# EAGLE schematic DuinoMite_Rev_C (EAGLE 4.16)
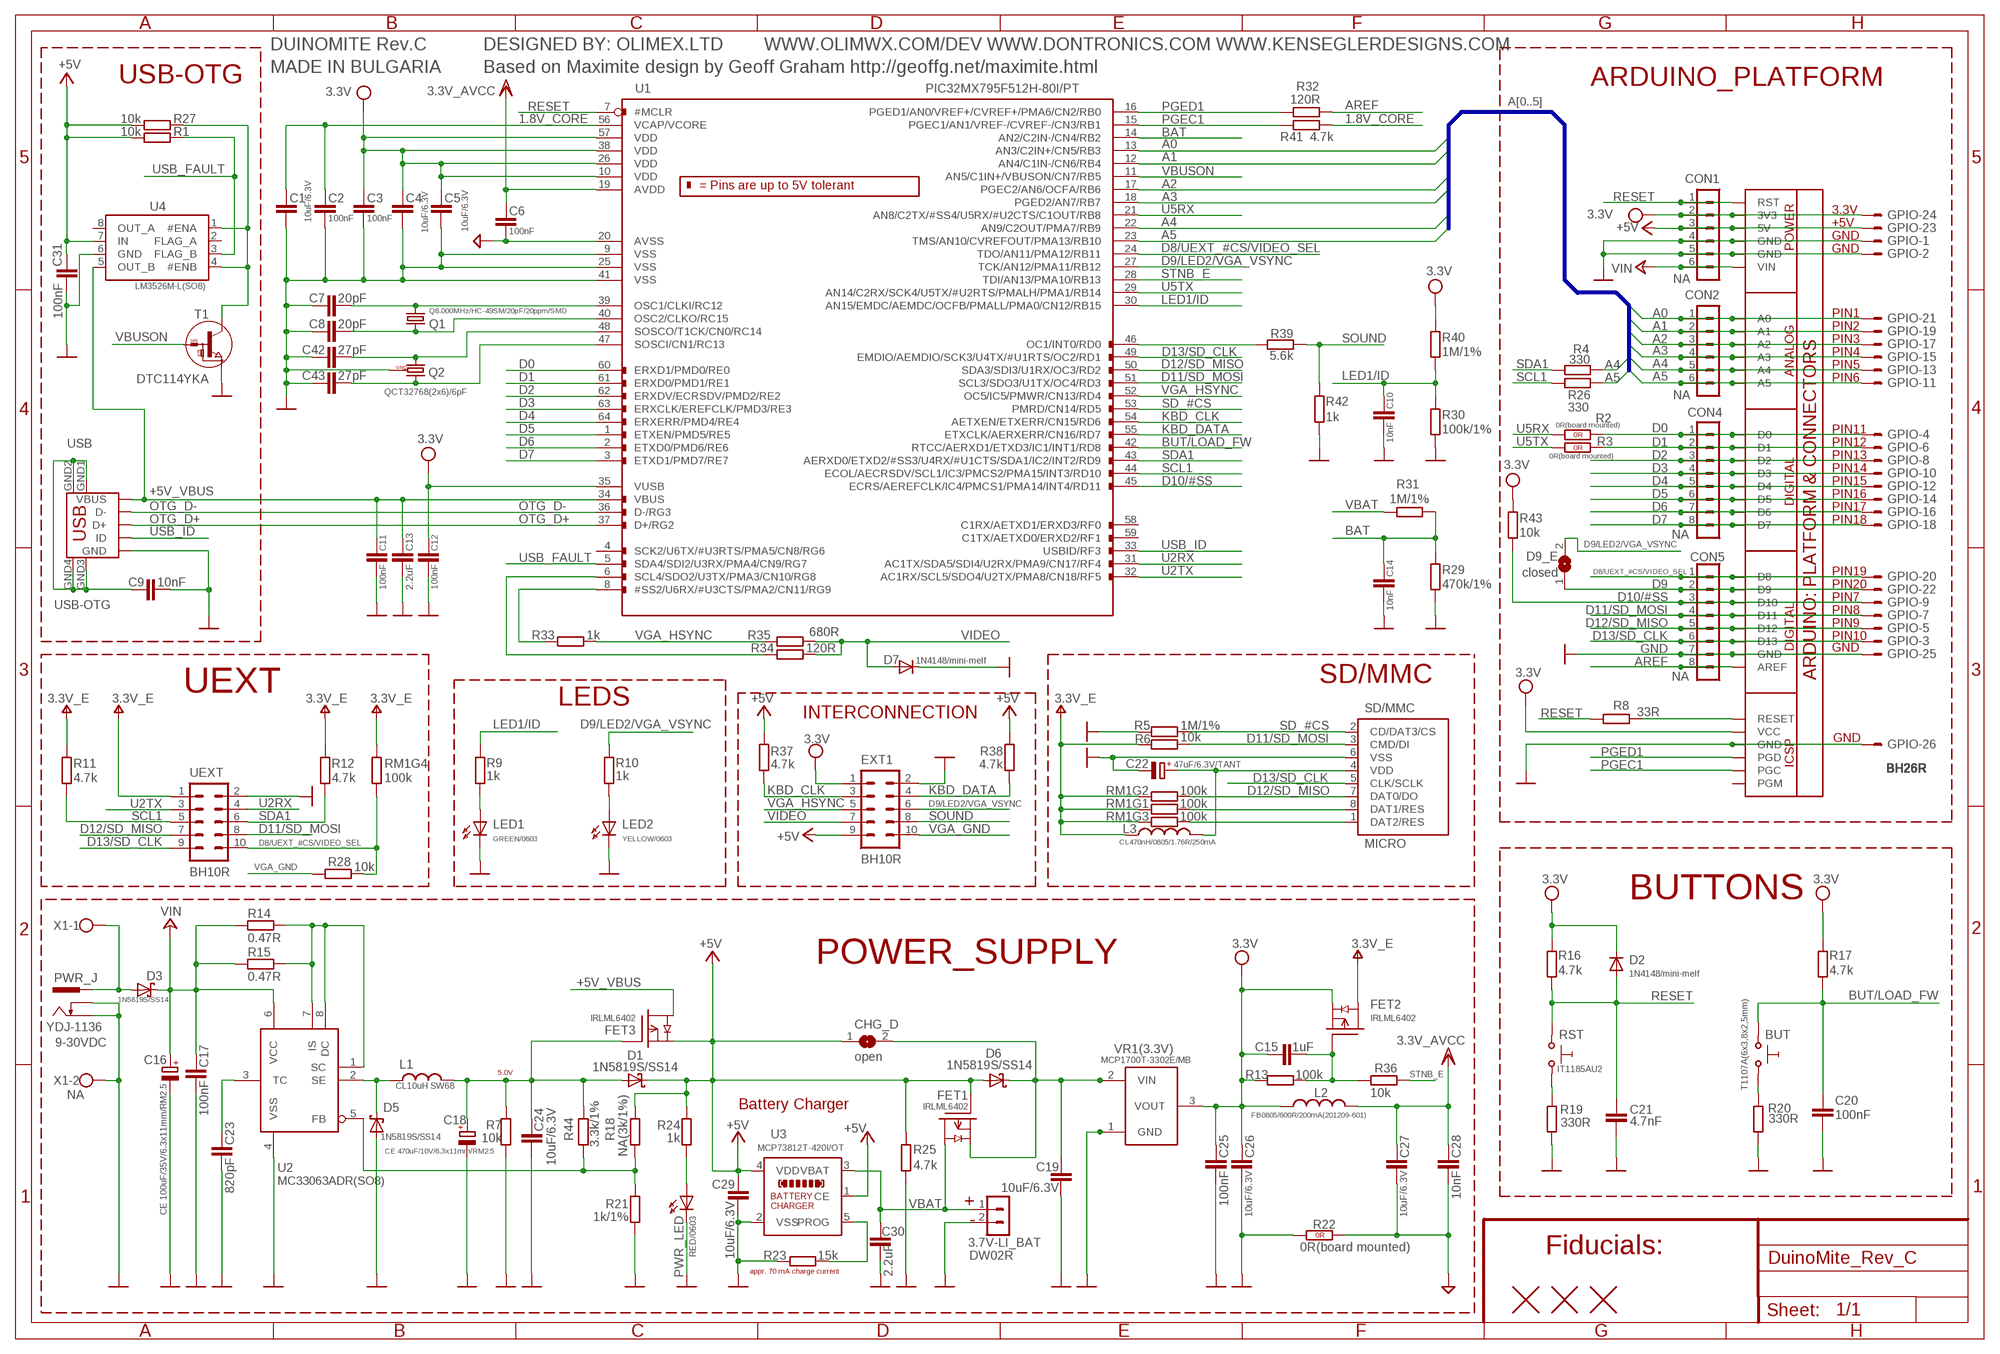
[diagram p0: schematic, sheet 1]

## Parts
3.7V-LI_BAT  DW02R  CON2DW02R  [DW02R]
BUT  T1107A(6x3,8x2,5mm)  SW-TAKTT1107A(6X3,8X2,5MM)  [WS-TAKT_6X3.5_SMD_NOCREAM]
C1  10uF/6.3V  C-EUC0805_5MIL_DWS  [C0805_5MIL_DWS]
C2  100nF  C-EUC0603_DWS  [C0603_DWS]
C3  100nF  C-EUC0603_DWS  [C0603_DWS]
C4  10uF/6.3V  C-EUC0603_DWS  [C0603_DWS]
C5  10uF/6.3V  C-EUC0603_DWS  [C0603_DWS]
C6  100nF  C-EUC0603_DWS  [C0603_DWS]
C7  20pF  C-EUC0603_DWS  [C0603_DWS]
C8  20pF  C-EUC0603_DWS  [C0603_DWS]
C9  10nF  C-EUC0603_DWS  [C0603_DWS]
C10  10nF  C-EUC0603_DWS  [C0603_DWS]
C11  100nF  C-EUC0603_DWS  [C0603_DWS]
C12  100nF  C-EUC0603_DWS  [C0603_DWS]
C13  2.2uF  C-EUC0603_DWS  [C0603_DWS]
C14  10nF  C-EUC0603_DWS  [C0603_DWS]
C15  1uF  C-EUC0603_DWS  [C0603_DWS]
C16  CE 100uF/35V/6.3x11mm/RM2.5  CPOL-EUE2.5-6.3  [E2,5-6,3]
C17  100nF  C-EUC0603_DWS  [C0603_DWS]
C18  CE 470uF/10V/6.3x11mm/RM2.5  CPOL-EUE2.5-6.3  [E2,5-6,3]
C19  10uF/6.3V  C-EUC0603_DWS  [C0603_DWS]
C20  100nF  C-EUC0603_DWS  [C0603_DWS]
C21  4.7nF  C-EUC0603_DWS  [C0603_DWS]
C22  47uF/6.3V/TANT  CPOL-EUCT3528  [CT3528]
C23  820pF  C-EUC0603_DWS  [C0603_DWS]
C24  10uF/6.3V  C-EUC0805_5MIL_DWS  [C0805_5MIL_DWS]
C25  100nF  C-EUC0603_DWS  [C0603_DWS]
C26  10uF/6.3V  C-EUC0805_5MIL_DWS  [C0805_5MIL_DWS]
C27  10uF/6.3V  C-EUC0805_5MIL_DWS  [C0805_5MIL_DWS]
C28  10nF  C-EUC0603_DWS  [C0603_DWS]
C29  10uF/6.3V  C-EUC0603_DWS  [C0603_DWS]
C30  2.2uF  C-EUC0603_DWS  [C0603_DWS]
C31  100nF  C-EUC0603_DWS  [C0603_DWS]
C42  27pF  C-EUC0603_DWS  [C0603_DWS]
C43  27pF  C-EUC0603_DWS  [C0603_DWS]
CHG_D  open  SJSJ_SMALLER  [SJ_1_SMALLER]
CON1  NA  CON6PN1X6  [PN1X6]
CON2  NA  CON6PN1X6  [PN1X6]
CON4  NA  CON8PN1X8  [PN1X8]
CON5  NA  CON8PN1X8  [PN1X8]
D1  1N5819S/SS14  SCHOTKKY7.62SS2  [MLL-41]
D2  1N4148/mini-melf  DSMD  [MINI-MELF]
D3  1N5819S/SS14  SCHOTKKY7.62SS2  [MLL-41]
D5  1N5819S/SS14  SCHOTKKY7.62SS2  [MLL-41]
D6  1N5819S/SS14  SCHOTKKY7.62SS2  [MLL-41]
D7  1N4148/mini-melf  DSMD  [MINI-MELF]
D9_E  closed  SJSJ_1_SMALLER_CLOSE  [SJ_1_SMALLER_CLOSE]
EXT1  BH10R  ML10R  [BH10R]
FET1  IRLML6402  [SOT23]
FET2  IRLML6402  [SOT23]
FET3  IRLML6402  [SOT23]
GPIO  BH26R  ML26RE  [BH26R]
L1  CL10uH SW68  LSW68  [SW68]
L2  FB0805/600R/200mA(201209-601)  L-USL0805_5MIL_DWS  [L0805_5MIL_DWS]
L3  CL470nH/0805/1.76R/250mA  L-USL0805_5MIL_DWS  [L0805_5MIL_DWS]
LED1  GREEN/0603  LED0603DWS  [LED-0603]
LED2  YELLOW/0603  LED0603DWS  [LED-0603]
PWR_J  YDJ-1136  PWR-JAKPWR_JACK_UNI_MILLING  [PWR_JACK_UNI_MILLING]
PWR_LED  RED/0603  LED0603DWS  [LED-0603]
Q1  Q8.000MHz/HC-49SM/20pF/20ppm/SMD  HC49/S1  [HC49/SMD2_THIN]
Q2  QCT32768(2x6)/6pF  Q_GND1  [TC26H_3_REPAIR_SMD]
R1  10k  R-EU_R0603_5MIL_DWS  [R0603_5MIL_DWS]
R2  0R(board mounted)  R_0R0R(NA)  [0603_0R]
R3  0R(board mounted)  R_0R0R(NA)  [0603_0R]
R4  330  R-EU_R0603_5MIL_DWS  [R0603_5MIL_DWS]
R5  1M/1%  R-EU_R0603_5MIL_DWS  [R0603_5MIL_DWS]
R6  10k  R-EU_R0603_5MIL_DWS  [R0603_5MIL_DWS]
R7  10k  R-EU_R0603_5MIL_DWS  [R0603_5MIL_DWS]
R8  33R  R-EU_R0603_5MIL_DWS  [R0603_5MIL_DWS]
R9  1k  R-EU_R0603_5MIL_DWS  [R0603_5MIL_DWS]
R10  1k  R-EU_R0603_5MIL_DWS  [R0603_5MIL_DWS]
R11  4.7k  R-EU_R0603_5MIL_DWS  [R0603_5MIL_DWS]
R12  4.7k  R-EU_R0603_5MIL_DWS  [R0603_5MIL_DWS]
R13  100k  R-EU_R0603_5MIL_DWS  [R0603_5MIL_DWS]
R14  0.47R  R-EU_R1206_5MIL_WS  [R1206_5MIL_WS]
R15  0.47R  R-EU_R1206_5MIL_WS  [R1206_5MIL_WS]
R16  4.7k  R-EU_R0603_5MIL_DWS  [R0603_5MIL_DWS]
R17  4.7k  R-EU_R0603_5MIL_DWS  [R0603_5MIL_DWS]
R18  NA(3k/1%)  R-EU_R0603_5MIL_DWS  [R0603_5MIL_DWS]
R19  330R  R-EU_R0603_5MIL_DWS  [R0603_5MIL_DWS]
R20  330R  R-EU_R0603_5MIL_DWS  [R0603_5MIL_DWS]
R21  1k/1%  R-EU_R0603_5MIL_DWS  [R0603_5MIL_DWS]
R22  0R(board mounted)  R_0R0R(NA)  [0603_0R]
R23  15k  R-EU_R0603_5MIL_DWS  [R0603_5MIL_DWS]
R24  1k  R-EU_R0603_5MIL_DWS  [R0603_5MIL_DWS]
R25  4.7k  R-EU_R0603_5MIL_DWS  [R0603_5MIL_DWS]
R26  330  R-EU_R0603_5MIL_DWS  [R0603_5MIL_DWS]
R27  10k  R-EU_R0603_5MIL_DWS  [R0603_5MIL_DWS]
R28  10k  R-EU_R0603_5MIL_DWS  [R0603_5MIL_DWS]
R29  470k/1%  R-EU_R0603_5MIL_DWS  [R0603_5MIL_DWS]
R30  100k/1%  R-EU_R0603_5MIL_DWS  [R0603_5MIL_DWS]
R31  1M/1%  R-EU_R0603_5MIL_DWS  [R0603_5MIL_DWS]
R32  120R  R-EU_R0603_5MIL_DWS  [R0603_5MIL_DWS]
R33  1k  R-EU_R0603_5MIL_DWS  [R0603_5MIL_DWS]
R34  120R  R-EU_R0603_5MIL_DWS  [R0603_5MIL_DWS]
R35  680R  R-EU_R0603_5MIL_DWS  [R0603_5MIL_DWS]
R36  10k  R-EU_R0603_5MIL_DWS  [R0603_5MIL_DWS]
R37  4.7k  R-EU_R0603_5MIL_DWS  [R0603_5MIL_DWS]
R38  4.7k  R-EU_R0603_5MIL_DWS  [R0603_5MIL_DWS]
R39  5.6k  R-EU_R0603_5MIL_DWS  [R0603_5MIL_DWS]
R40  1M/1%  R-EU_R0603_5MIL_DWS  [R0603_5MIL_DWS]
R41  4.7k  R-EU_R0603_5MIL_DWS  [R0603_5MIL_DWS]
R42  1k  R-EU_R0603_5MIL_DWS  [R0603_5MIL_DWS]
R43  10k  R-EU_R0603_5MIL_DWS  [R0603_5MIL_DWS]
R44  3.3k/1%  R-EU_R0603_5MIL_DWS  [R0603_5MIL_DWS]
RM1  100k  R_MATRIX_4E  [R_MATRIX_4]
RST  IT1185AU2  SW-TAKTIT1185AU2  [IT1185AU2]
SD/MMC  MICRO  MICRO_SD/MMC  [TFR-MEM-CON]
T1  DTC114YKA  DIGITAL_TRANSISTORS-NPNDTC114YKA  [SOT-23]
U1  PIC32MX795F512H-80I/PT  PIC32MX795F512HT-80I/PT  [LPTQFP64]
U2  MC33063ADR(SO8)  MC34063A_OFF  [SO-8_TRM]
U3  MCP73812T-420I/OT  MCP7381XSOT-23-5  [SOT-23-5]
U4  LM3526M-L(SO8)  LM3526-L  [SO-8]
U$1  2xPN1x8+2xPN1x6+WU06S  PIC_PLATFORMMITE  [PIC_PLATFORM_MAXMITE]
U$2  FIDUCIAL1X2  [FIDUCIAL-1X2]
U$3  FIDUCIAL1X2  [FIDUCIAL-1X2]
U$4  FIDUCIAL1X2  [FIDUCIAL-1X2]
UEXT  BH10R  ML10R  [BH10R]
USB  USB-OTG  MINI_USB9  [USB_MINI_9PIN]
VR1(3.3V)  MCP1700T-3302E/MB  MCP1700-REP1  [SOT89_REP_THERMALOFF]
X1  NA  W237-102  [W237-102]

## Nets
1.8V_CORE: C1.1 C2.1 R41.1 U1.56(VCAP/VCORE)
+5V: C29.1 C31.1 CHG_D.1 CON1.3 D1.K(C) D6.A EXT1.9 FET1.1(G) FET3.2(S) GPIO.23 R1.2 R18.1 R24.1 R25.1 R27.2 R37.2 R38.2 U3.1(CE) U3.4(VDD) U4.7(IN) U$1.5V
+5V_VBUS [pwr]: C11.2 C13.1 FET3.3(D) U1.34(VBUS) U4.5(OUT_B) USB.VBUS
+24V: C16.+ C17.1 CON1.6 D3.K(C) R14.1 R15.1 U2.6(VCC) U$1.VIN ; supply symbol labelled VIN
A0: CON2.1 GPIO.21 U1.13(AN3/C2IN+/CN5/RB3) U$1.A0
A1: CON2.2 GPIO.19 U1.12(AN4/C1IN-/CN6/RB4) U$1.A1
A2: CON2.3 GPIO.17 U1.17(PGEC2/AN6/OCFA/RB6) U$1.A2
A3: CON2.4 GPIO.15 U1.18(PGED2/AN7/RB7) U$1.A3
A4: CON2.5 GPIO.13 R4.1 U1.22(AN9/C2OUT/PMA7/RB9) U$1.A4
A5: CON2.6 GPIO.11 R26.1 U1.23(TMS/AN10/CVREFOUT/PMA13/RB10) U$1.A5
AGND: C6.2 C27.2 C28.2 R22.2(1.2) U1.20(AVSS)
AREF: CON5.8 R32.1 U$1.AREF
BAT: C14.2 R29.2 R31.1 U1.14(AN2/C2IN-/CN4/RB2)
BUT/LOAD_FW: BUT.P$1 C20.1 R17.2 U1.42(RTCC/AERXD1/ETXD3/IC1/INT1/RD8)
D0: CON4.1 GPIO.4 R2.2(1.2) U1.60(ERXD1/PMD0/RE0) U$1.D0
D1: CON4.2 GPIO.6 R3.2(1.2) U1.61(ERXD0/PMD1/RE1) U$1.D1
D2: CON4.3 GPIO.8 U1.62(ERXDV/ECRSDV/PMD2/RE2) U$1.D2
D3: CON4.4 GPIO.10 U1.63(ERXCLK/EREFCLK/PMD3/RE3) U$1.D3
D4: CON4.5 GPIO.12 U1.64(ERXERR/PMD4/RE4) U$1.D4
D5: CON4.6 GPIO.14 U1.1(ETXEN/PMD5/RE5) U$1.D5
D6: CON4.7 GPIO.16 U1.2(ETXD0/PMD6/RE6) U$1.D6
D7: CON4.8 GPIO.18 U1.3(ETXD1/PMD7/RE7) U$1.D7
D8/UEXT_#CS/VIDEO_SEL: CON5.1 GPIO.20 R28.2 RM1.4.2 U1.24(TDO/AN11/PMA12/RB11) U$1.D8 UEXT.10
D9: CON5.2 D9_E.1 GPIO.22 U$1.D9
D9/LED2/VGA_VSYNC: D9_E.2 EXT1.6 R10.2 U1.27(TCK/AN12/PMA11/RB12)
D10/#SS: CON5.3 GPIO.9 R43.1 U1.45(ECRS/AEREFCLK/IC4/PMCS1/PMA14/INT4/RD11) U$1.D10
D11/SD_MOSI: CON5.4 GPIO.7 R6.1 SD/MMC.3(CMD/DI) U1.51(SCL3/SDO3/U1TX/OC4/RD3) U$1.D11 UEXT.8
D12/SD_MISO: CON5.5 GPIO.5 RM1.2.2 SD/MMC.7(DAT0/DO) U1.50(SDA3/SDI3/U1RX/OC3/RD2) U$1.D12 UEXT.7
D13/SD_CLK: CON5.6 GPIO.3 SD/MMC.5(CLK/SCLK) U1.49(EMDIO/AEMDIO/SCK3/U4TX/#U1RTS/OC2/RD1) U$1.D13 UEXT.9
GND [pwr]: 3.7V-LI_BAT.2 C1.2 C2.2 C3.2 C4.2 C5.2 C7.1 C8.1 C9.1 C10.1 C11.1 C12.1 C13.2 C14.1 C16.- C17.2 C18.- C19.2 C20.2 C21.2 C22.- C23.2 C24.2 C25.2 C26.2 C29.2 C30.2 C31.2 C42.1 C43.1 CON1.4 CON1.5 CON5.7 D5.A D7.C(K) EXT1.2 GPIO.1 GPIO.2 GPIO.25 GPIO.26 LED1.C LED2.C PWR_J.- PWR_J.-- PWR_LED.C Q2.GND R5.2 R7.2 R19.1 R20.1 R21.2 R22.1(1.1) R23.1 R25.2 R29.1 R30.1 R42.1 SD/MMC.6(VSS) T1.2(E) U1.9(VSS) U1.25(VSS) U1.41(VSS) U2.4(VSS) U3.2(VSS) U4.6(GND) U$1.GND U$1.GND@1(GND) U$1.GND@2(GND) U$1.GND@3(GND) UEXT.2 USB.GND VR1(3.3V).1(GND) X1.2
KBD_CLK: EXT1.3 R37.1 U1.54(AETXEN/ETXERR/CN15/RD6)
KBD_DATA: EXT1.4 R38.1 U1.55(ETXCLK/AERXERR/CN16/RD7)
LED1/ID: C10.2 R9.2 R30.2 R40.1 U1.30(AN15/EMDC/AEMDC/OCFB/PMALL/PMA0/CN12/RB15)
MCIDAT1: RM1.1.2 SD/MMC.8(DAT1/RES)
MCIDAT2: RM1.3.2 SD/MMC.1(DAT2/RES)
N$1: C18.+ C24.1 D1.A FET3.1(G) L1.2 R7.1 R44.1
N$2: C42.2 Q2.1 U1.48(SOSCO/T1CK/CN0/RC14)
N$3: R39.1 U1.46(OC1/INT0/RD0)
N$4: R8.1 U$1.RESET
N$5: LED2.A R10.1
N$6: R27.1 T1.3(C) U4.1(#ENA) U4.4(#ENB)
N$8: PWR_LED.A R24.2
N$9: C15.2 FET2.1(G) R13.2 R36.1
N$11 [pwr]: R19.2 RST.2
N$12 [pwr]: BUT.P$2 R20.2
N$13: D3.A PWR_J.+ X1.1
N$17: C7.2 Q1.2 U1.39(OSC1/CLKI/RC12)
N$18: R34.1 U1.6(SCL4/SDO2/U3TX/PMA3/CN10/RG8)
N$19: C8.2 Q1.1 U1.40(OSC2/CLKO/RC15)
N$22: R23.2 U3.5(PROG)
N$23: LED1.A R9.1
N$24: R33.1 U1.8(#SS2/U6RX/#U3CTS/PMA2/CN11/RG9)
N$28: C43.2 Q2.2 U1.47(SOSCI/CN1/RC13)
N$33: C23.1 U2.3(TC)
N$34: C19.1 CHG_D.2 D6.K(C) FET1.2(S) VR1(3.3V).2(VIN) VR1(3.3V).P$2(VIN1)
N$61: R18.2 R21.1 R44.2 U2.5(FB)
N$64: R14.2 R15.2 U2.1(SC) U2.7(IS) U2.8(DC)
N$67 [pwr]: D5.K(C) L1.1 U2.2(SE)
N$116: C22.+ L3.2 SD/MMC.4(VDD)
OTG_D+: U1.37(D+/RG2) USB.D+
OTG_D-: U1.36(D-/RG3) USB.D-
PGEC1: R41.2 U1.15(PGEC1/AN1/VREF-/CVREF-/CN3/RB1) U$1.PGC
PGED1: R32.2 U1.16(PGED1/AN0/VREF+/CVREF+/PMA6/CN2/RB0) U$1.PGD
RESET: C21.1 CON1.1 D2.A R8.2 R16.2 RST.1 U1.7(#MCLR) U$1.RST
SCL1: R11.1 R26.2 U1.44(ECOL/AECRSDV/SCL1/IC3/PMCS2/PMA15/INT3/RD10) UEXT.5
SD_#CS: R5.1 SD/MMC.2(CD/DAT3/CS) U1.53(PMRD/CN14/RD5)
SDA1: R4.2 R12.1 U1.43(AERXD0/ETXD2/#SS3/U4RX/#U1CTS/SDA1/IC2/INT2/RD9) UEXT.6
SOUND: EXT1.8 R39.2 R42.2
STNB_E: R36.2 U1.28(TDI/AN13/PMA10/RB13)
U2RX: U1.31(AC1TX/SDA5/SDI4/U2RX/PMA9/CN17/RF4) UEXT.4
U2TX: U1.32(AC1RX/SCL5/SDO4/U2TX/PMA8/CN18/RF5) UEXT.3
U5RX: R2.1(1.1) U1.21(AN8/C2TX/#SS4/U5RX/#U2CTS/C1OUT/RB8)
U5TX: R3.1(1.1) U1.29(AN14/C2RX/SCK4/U5TX/#U2RTS/PMALH/PMA1/RB14)
USB_FAULT: R1.1 U1.5(SDA4/SDI2/U3RX/PMA4/CN9/RG7) U4.3(FLAG_B)
USB_ID: U1.33(USBID/RF3) USB.ID
USB_SHIELD: C9.2 USB.GND1 USB.GND2 USB.GND3 USB.GND4
V+: FET2.3(D) L3.1 R6.2 R11.2 R12.2 RM1.1.1 RM1.2.1 RM1.3.1 RM1.4.1 UEXT.1 ; supply symbol labelled 3.3V_E
VBAT: 3.7V-LI_BAT.1 C30.1 FET1.3(D) R31.2 U3.3(VBAT)
VBUSON: T1.1(B) U1.11(AN5/C1IN+/VBUSON/CN7/RB5)
VCC: C3.1 C4.1 C5.1 C12.2 C15.1 C25.1 C26.1 CON1.2 D2.C(K) EXT1.1 FET2.2(S) GPIO.24 L2.1 R13.1 R16.1 R17.1 R40.2 R43.2 U1.10(VDD) U1.26(VDD) U1.35(VUSB) U1.38(VDD) U1.57(VDD) U$1.3V3 U$1.VCC VR1(3.3V).3(VOUT) ; supply symbol labelled 3.3V
VDD: C6.1 C27.1 C28.1 L2.2 U1.19(AVDD) ; supply symbol labelled 3.3V_AVCC
VGA_GND: EXT1.10 R28.1
VGA_HSYNC: EXT1.5 R33.2 R35.1 U1.52(OC5/IC5/PMWR/CN13/RD4)
VIDEO: D7.A EXT1.7 R34.2 R35.2
Unconnected: U1.4(SCK2/U6TX/#U3RTS/PMA5/CN8/RG6) U1.58(C1RX/AETXD1/ERXD3/RF0) U1.59(C1TX/AETXD0/ERXD2/RF1) U4.2(FLAG_A) U4.8(OUT_A) U$1.PGM

## Buses
A[0..5]

## Notes on the sheet
- DUINOMITE Rev.C | DESIGNED BY: OLIMEX.LTD | WWW.OLIMWX.COM/DEV | WWW.DONTRONICS.COM | WWW.KENSEGLERDESIGNS.COM
- MADE IN BULGARIA | Based on Maximite design by Geoff Graham http://geoffg.net/maximite.html
- USB-OTG | ARDUINO_PLATFORM
- 3.3V
- +5V
- GND
- GND
- PIN1
- PIN2
- PIN3
- PIN4
- PIN5
- PIN6
- PIN11
- PIN12
- PIN13
- PIN14
- PIN15
- PIN16
- PIN17
- PIN18
- PIN19
- PIN20
- PIN7
- PIN8
- PIN9
- PIN10
- GND
- SD/MMC
- UEXT
- LEDS
- INTERCONNECTION
- GND
- BUTTONS
- POWER_SUPPLY
- 9-30VDC
- 5.0V
- Battery Charger
- +
- -
- Fiducials:
- appr. 70 mA charge current

## Library data of the parts
3.7V-LI_BAT = Penko:CON2
BUT RST = gogo:SW-TAKT
C1-C15 C17 C19-C21 C23-C31 C42 C43 = rcl:C-EU: CAPACITOR, European symbol
C16 C18 C22 = rcl:CPOL-EU: POLARIZED CAPACITOR, European symbol
CHG_D D9_E = jumper:SJ: SMD solder JUMPER
CON1 CON2 = Penko:CON6: CONNECTORS - 6 PINS
CON4 CON5 = Penko:CON8
D1 D3 D5 D6 = gogo:SCHOTKKY7.62SS
D2 D7 = DOUBLE-SIDE:D: DIODES
EXT1 UEXT = con-harting-ml:ML10: HARTING
FET1-FET3 = gogo:IRLML6402
GPIO = con-harting-ml:ML26?E: HARTING
L1 = DOUBLE-SIDE:L
L2 L3 = rcl:L-US: INDUCTOR, American symbol
LED1 LED2 PWR_LED = DOUBLE-SIDE:LED
PWR_J = gogo:PWR-JAK
Q1 = crystal:HC49/S: CRYSTAL
Q2 = crystal:Q_GND
R1 R4-R21 R23-R44 = rcl:R-EU_: RESISTOR, European symbol
R2 R3 R22 = OLIMEX_DISCRET:R_0R
RM1 = OLIMEX_DISCRET:R_MATRIX_4E
SD/MMC = OLIMEX_CONNECTORS:MICRO_SD/MMC
T1 = OLIMEX_DISCRET:DIGITAL_TRANSISTORS-NPN: DTC114YKA Digital Transistor - NPN
U1 = OLIMEX_IC:PIC32MX795F512H
U2 = MPLAB_ICD2:MC34063A
U3 = OLIMEX_DISCRET:MCP7381X
U4 = OLIMEX_IC:LM3526-L: LM3526 Dual Port USB Power Switch and Over-Current Protection Features: -> Compatible with USB1.1 and USB2.0; -> 1 ms fault flag delay filters Hot-Plug events; -> Smooth turn-on eliminates in-rush induced voltage drop; -> UL recognized component: REF#205202; -> 1A nominal shortcircuit output current protects PC power supplies; -> Thermal shutdown protects device in direct short condition; -> 500mA minimum continuous load current; -> Small SO-8 package minimizes board space; -> 2.7V to 5.5V input voltage range; -> 140mOhm Max.switch resistance; -> 1 µA Max. standby current; -> 200µA Max. operating current; -> Under-voltage lockout(UVLO);
U$1 = OLIMEX_CASES:PIC_PLATFORM
U$2-U$4 = SparkFunEagle-6-6-07:FIDUCIAL: Fiducial Alignment Points Various fiducial points for machine vision alignment.
USB = OLIMEX_CONNECTORS:MINI_USB9
VR1(3.3V) = OLIMEX_DISCRET:MCP1700-REP
X1 = con-wago-500:W237-102: WAGO SCREW CLAMP

## Net classes
1 pwr: width 0.25 mm